# EAGLE board MOMO_2019 (EAGLE 7.3.0)
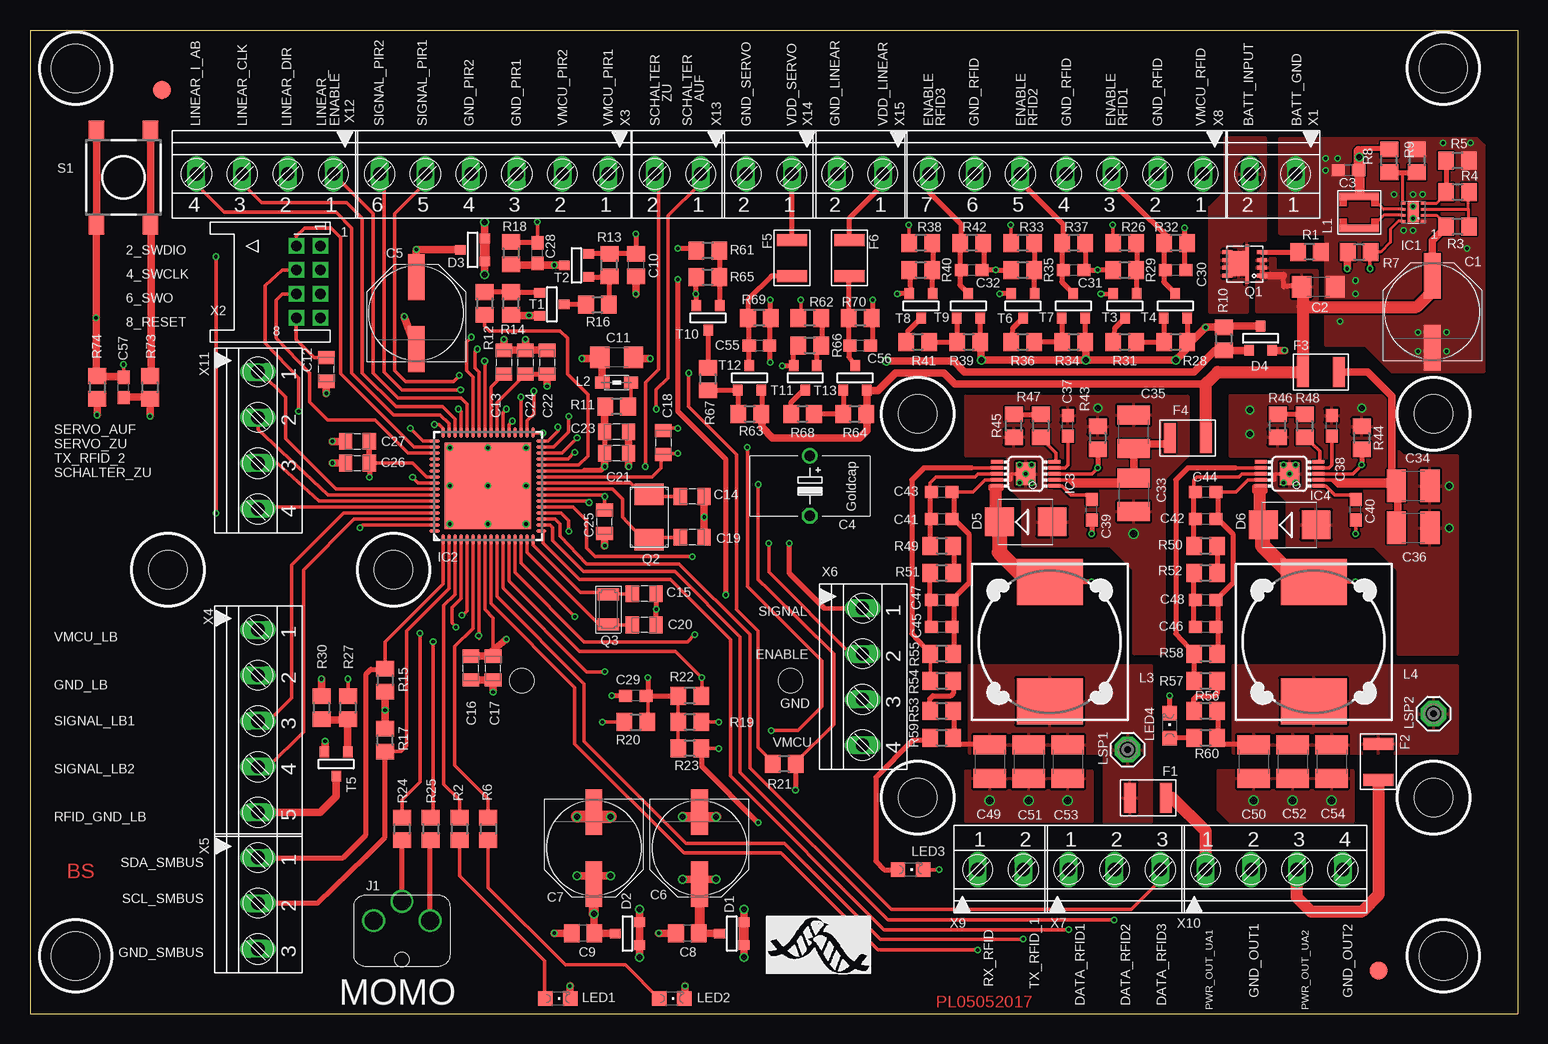
[diagram p6: board, top side]
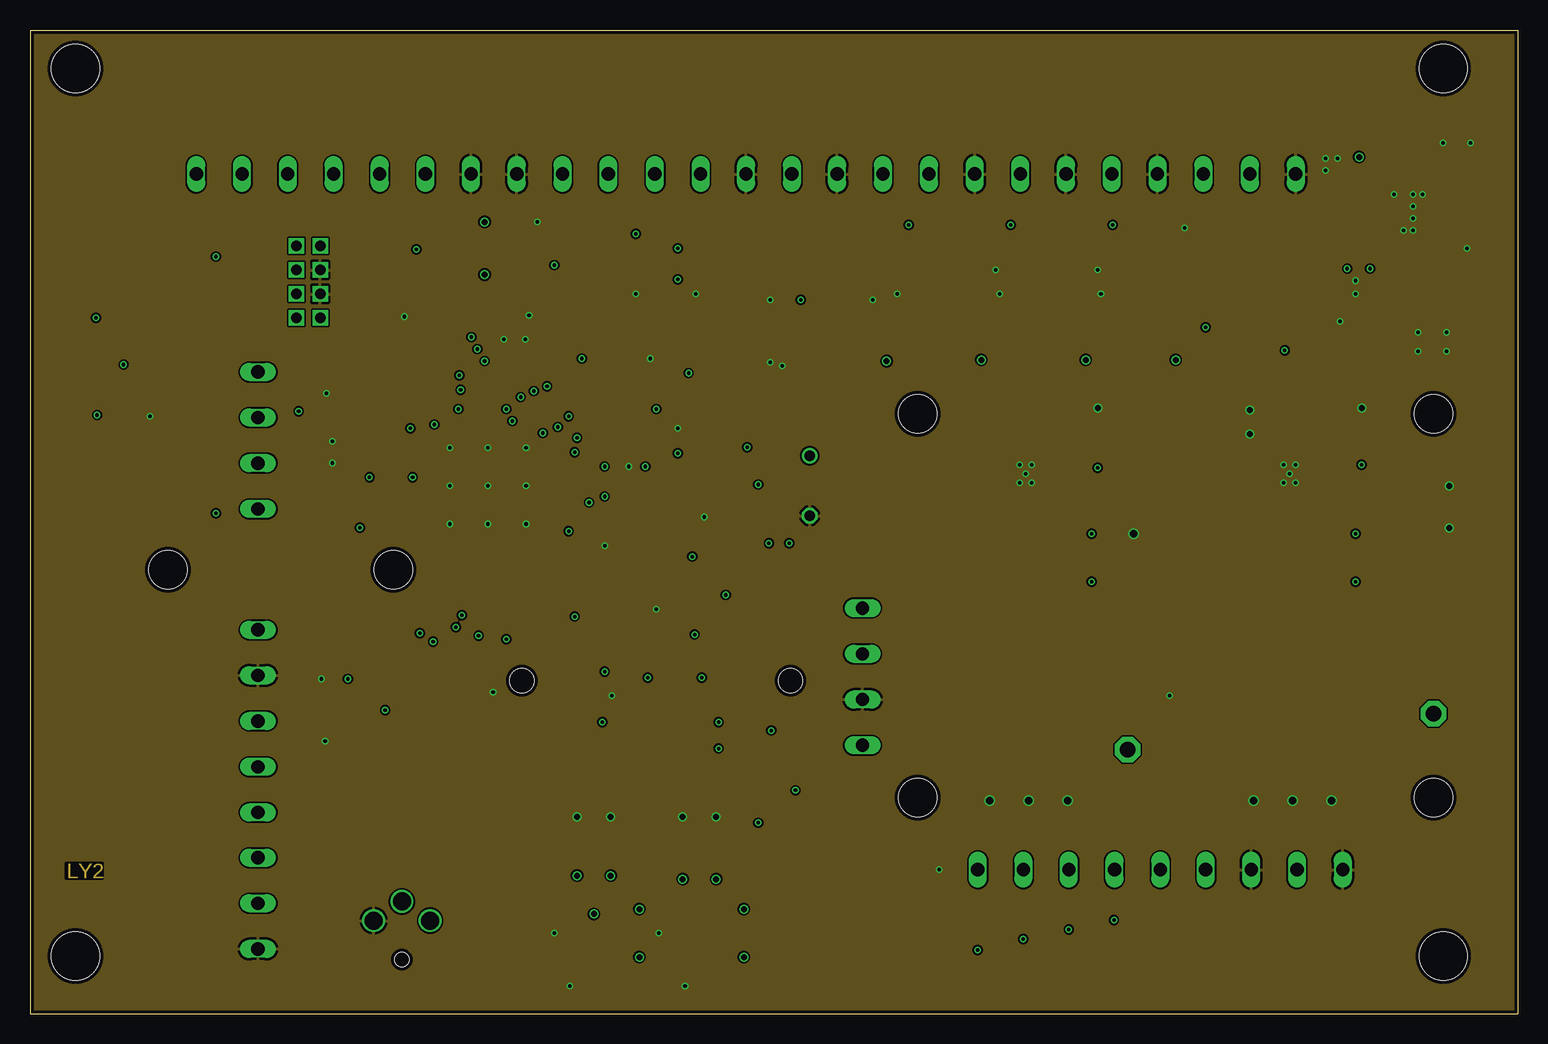
[diagram p7: board, inner layer Route2]
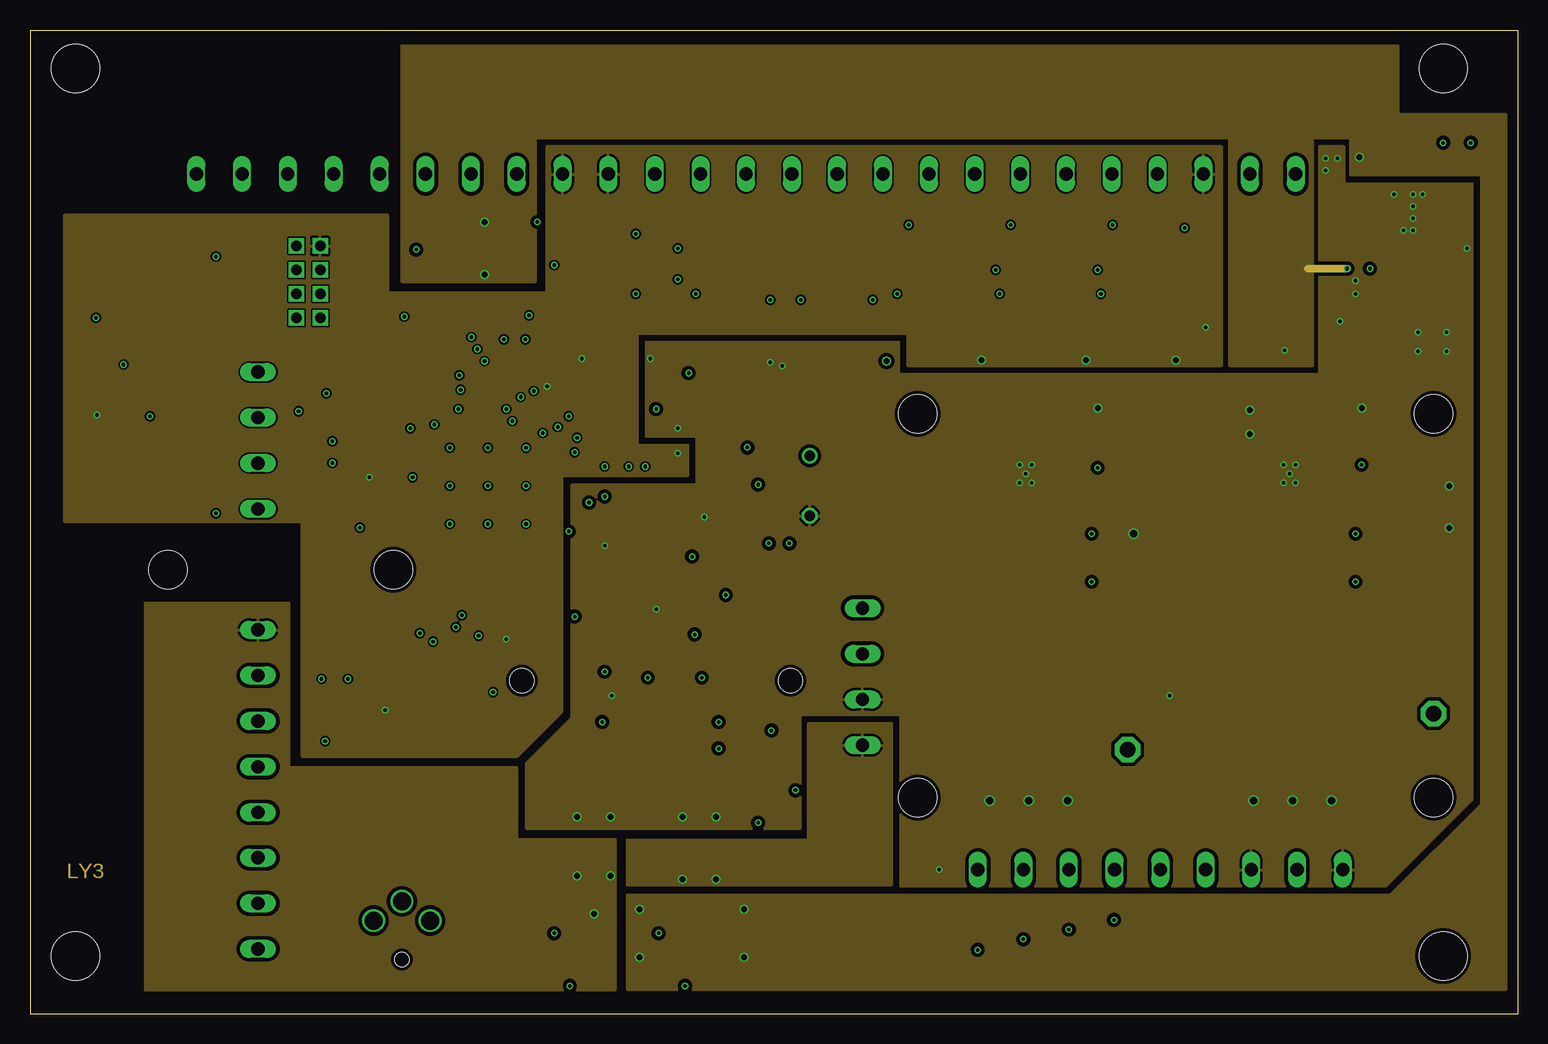
[diagram p8: board, inner layer Route3]
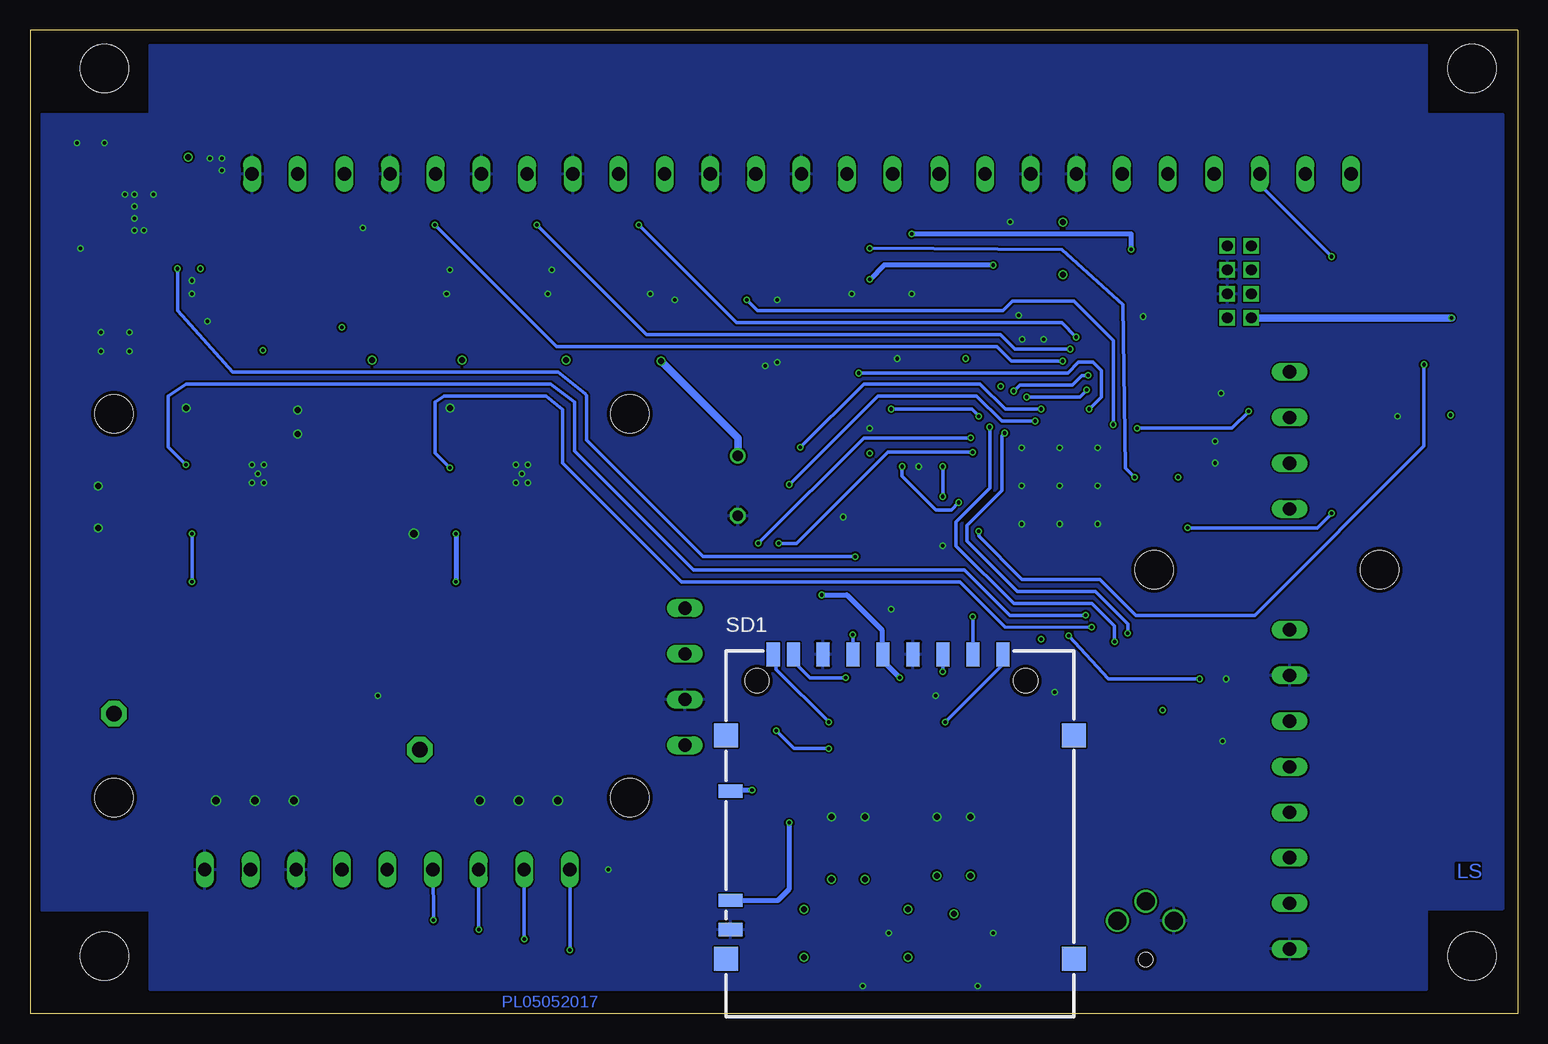
[diagram p9: board, bottom side, seen from below]

Size 124 x 82 mm. Coordinates in mm from the lower left corner, seen from the top.
Outline: 0,0 124,0 124,82 0,82 0,0
Copper layers (1+2*3+16): Top 0.035mm / dielectric 0.2mm / Route2 0.035mm / dielectric 1mm / Route3 0.035mm / dielectric 0.2mm / Bottom 0.035mm
Design rules "PCB-POOL HighSpec *": minimum track width 0.125mm, minimum drill 0.2mm, track to track 0.15mm, track to pad 0.15mm, pad to pad 0.15mm, via to via 0.15mm, smd to smd 0mil, copper to edge 0.3mm, drill to drill 0.2mm, minimum pad ring 0.2mm, minimum via ring 0.125mm, stop-mask expansion 0.075mm, vias tented up to drill 0mil, thermal gap 0.2mm
Net classes: 1 GND: width 0.2 mm; 2 VCC: width 0.25 mm
Holes 4 mm at 3.8,4.8 3.8,78.8 117.8,78.8 117.8,4.8
Holes 3.2 mm at 11.5,37 30.3,37 74,18 117,18 117,50 74,50

## Footprints (pad centres in the part's own frame; a part is rotated, then mirrored left to right if it is on the bottom)
PANASONIC_E = smd 3.8 x 1.4: + 3,0; - -3,0
C1206 = smd 1.6 x 1.8: 1 -1.4,0; 2 1.4,0
C0603 = smd 1.1 x 1: 1 -0.85,0; 2 0.85,0
GOLDCAPSPK-V = drill 0.9: + -2.5,0 | drill 0.9 octagon: - 2.5,0
C0805 = smd 1.3 x 1.5: 1 -0.95,0; 2 0.95,0
0805 = smd 1.092 x 1.397: 1 -0.991,0; 2 0.991,0
C1210 = smd 1.6 x 2.7: 1 -1.4,0; 2 1.4,0
SOT-23$1 = smd 0.787 x 0.889: 1 0.025,-1.016; 2 -0.94,1.016; 3 0.991,1.016
SMB = smd 2.4 x 2.4: A 2.2,0; C -2.2,0
PFUF_1210POLY = smd 1 x 2.5: P$1 -1.5,0; P$2 1.5,0
DSG_PWSO-N8_EXP = smd 0.2 x 0.4: 1 -0.75,-0.85; 2 -0.25,-0.85; 3 0.25,-0.85; 4 0.75,-0.85; 5 0.75,0.85; 6 0.25,0.85; 7 -0.25,0.85; 8 -0.75,0.85 | smd 1.6 x 0.9: EXP 0,0
QFN64 = smd 0.85 x 0.3: 1 -4.45,3.75; 2 -4.45,3.25; 3 -4.45,2.75; 4 -4.45,2.25; 5 -4.45,1.75; 6 -4.45,1.25; 7 -4.45,0.75; 8 -4.45,0.25; 9 -4.45,-0.25; 10 -4.45,-0.75; 11 -4.45,-1.25; 12 -4.45,-1.75; 13 -4.45,-2.25; 14 -4.45,-2.75; 15 -4.45,-3.25; 16 -4.45,-3.75; 33 4.45,-3.75; 34 4.45,-3.25; 35 4.45,-2.75; 36 4.45,-2.25; 37 4.45,-1.75; 38 4.45,-1.25; 39 4.45,-0.75; 40 4.45,-0.25; 41 4.45,0.25; 42 4.45,0.75; 43 4.45,1.25; 44 4.45,1.75; 45 4.45,2.25; 46 4.45,2.75; 47 4.45,3.25; 48 4.45,3.75 | smd 0.3 x 0.85: 17 -3.75,-4.45; 18 -3.25,-4.45; 19 -2.75,-4.45; 20 -2.25,-4.45; 21 -1.75,-4.45; 22 -1.25,-4.45; 23 -0.75,-4.45; 24 -0.25,-4.45; 25 0.25,-4.45; 26 0.75,-4.45; 27 1.25,-4.45; 28 1.75,-4.45; 29 2.25,-4.45; 30 2.75,-4.45; 31 3.25,-4.45; 32 3.75,-4.45; 49 3.75,4.45; 50 3.25,4.45; 51 2.75,4.45; 52 2.25,4.45; 53 1.75,4.45; 54 1.25,4.45; 55 0.75,4.45; 56 0.25,4.45; 57 -0.25,4.45; 58 -0.75,4.45; 59 -1.25,4.45; 60 -1.75,4.45; 61 -2.25,4.45; 62 -2.75,4.45; 63 -3.25,4.45; 64 -3.75,4.45 | smd 7.2 x 7.2: 65 0,0
S-PDSO-G10 = smd 0.3 x 1.02: 1 -1,-2.4; 2 -0.5,-2.4; 3 0,-2.4; 4 0.5,-2.4; 5 1,-2.4; 6 1,2.4; 7 0.5,2.4; 8 0,2.4; 9 -0.5,2.4; 10 -1,2.4 | smd 1.9 x 1.6: EXP 0,0
LUMBERG1502_01 = drill 1.5: P$1 -2.35,0.75; P$2 0,2.35; P$3 2.35,0.75 | hole 1.2: 0,-2.5
LPS3008 = smd 0.63 x 3.3: 1 -1.335,0; 2 1.335,0
0805' = smd 1.2 x 1: 1 -1.2,0; 2 1.2,0
DR127 = smd 3.85 x 5.5: 1 -4.975,0; 2 4.975,0
CHIPLED_0805 = smd 1.2 x 1.2: A 0,-1.05; C 0,1.05
SE13 = drill 1.321 pad 2.159 octagon: MP 0,0
ROUND2_1.5MM = smd 1.5 x 1.5: FID 0,0
TRANSISTOR-FET_1212-8S = smd 0.8 x 0.34: 1 -1.435,0.97; 2 -1.435,0.325; 3 -1.435,-0.325; 4 -1.435,-0.975; 5 1.435,-0.975; 6 1.435,-0.325; 7 1.435,0.325; 8 1.435,0.975 | smd 0.3 x 0.8: 9 -0.2,-1.225; 10 -0.2,1.25 | smd 1.7 x 2.1: 11 0.5,-0.015
CRYSTAL2P5.0X3.2 = smd 1.8 x 2.4: 1 -1.9,0; 2 1.9,0
CRYSTAL2P3.2X1.5 = smd 1 x 1.8: 1 -1.25,0; 2 1.25,0
R0805 = smd 1.3 x 1.5: 1 -0.95,0; 2 0.95,0
DTSM-6 = smd 1.55 x 1.3: 1 -3.975,2.25; 2 3.975,2.25; 3 -3.975,-2.25; 4 3.975,-2.25
DM1AA-SF-PEJ = smd 1.1 x 2: 1 6.1,14.95; 2 3.6,14.95; 3 1.1,14.95; 4 -1.4,14.95; 5 -3.9,14.95; 6 -6.4,14.95; 7 -8.85,14.95; 8 -10.55,14.95; 9 8.6,14.95 | smd 2 x 1.1: CDS -14.1,3.55; COM -14.1,-8; WPS -14.1,-5.566 | smd 2 x 2: G1 -14.5,8.2; G2 -14.5,-10.45; G3 14.5,-10.45; G4 14.5,8.2 | hole 2: -11.9,12.75; 10.5,12.75
ZETEX_SOT-23 = smd 0.787 x 0.889: 1 0.025,-1.016; 2 -0.94,1.016; 3 0.991,1.016
SOT-23 = smd 0.787 x 0.889: 1 0.025,-1.016; 2 -0.94,1.016; 3 0.991,1.016
2POL381 = drill 1.1 long: 1 0,0; 2 3.81,0
DP11_8DP-2DS = drill 0.9 square: 1 3,-9.2; 2 3,-7.2; 3 1,-9.2; 4 1,-7.2; 5 -1,-9.2; 6 -1,-7.2; 7 -3,-9.2; 8 -3,-7.2
6POL381 = drill 1.1 long: 1.1 0,0; 1.2 3.81,0; 1.3 7.62,0; 1.4 11.43,0; 1.5 15.24,0; 1.6 19.05,0
5POL381 = drill 1.1 long: 1 0,0; 2 3.81,0; 3 7.62,0; 4 11.43,0; 5 15.24,0
3POL381 = drill 1.1 long: 1 0,0; 2 3.81,0; 3 7.62,0
4POL381 = drill 1.1 long: 1 0,0; 2 3.81,0; 3 7.62,0; 4 11.43,0
7POL381 = drill 1.1 long: 1 0,0; 2 3.81,0; 3 7.62,0; 4 11.43,0; 5 15.24,0; 6 19.05,0; 7 22.86,0

## Placement (x,y rotation side)
C1  100µF/25V  [PANASONIC_E]  116.9,58.5 90 top
C2  10µF/25V  [C1206]  107.4,60.6 0 top
C3  22µF/10V  [C0603]  109.9,70.3 180 top
C4  EECS0HD 224;Panasonic  [GOLDCAPSPK-V]  65,44 270 top
C5  100µF/25V  [PANASONIC_E]  32.2,58.4 90 top
C6  100µF/25V  [PANASONIC_E]  55.8,13.8 270 top
C7  100µF/25V  [PANASONIC_E]  47,13.8 270 top
C8  100nF/16V  [C0805]  54.8,6.7 180 top
C9  100nF/16V  [C0805]  46.1,6.7 180 top
C10  100nF/16V  [C0805]  50.5,62.4 270 top
C11  10µ/25V  [C1206]  48.9,54.7 180 top
C12  100n  [0805]  24.7,53.7 90 top
C13  1u  [0805]  39.5,54.3 270 top
C14  12p  [0805]  55.2,43.1 180 top
C15  18p  [0805]  51.2,35 180 top
C16  100n  [0805]  36.75,28.8 90 top
C17  100n  [0805]  38.6,28.8 90 top
C18  100n  [0805]  52.8,47.6 270 top
C19  12p  [0805]  55.2,39.7 180 top
C20  18p  [0805]  51.2,32.4 180 top
C21  10µ  [0805]  48.9,46.7 180 top
C22  100n  [0805]  43.1,54.3 270 top
C23  100n  [0805]  48.9,48.5 180 top
C24  100n  [0805]  41.3,54.3 270 top
C25  100n  [0805]  47.9,41 90 top
C26  100n  [0805]  27.3,45.9 0 top
C27  10µ  [0805]  27.3,47.7 0 top
C28  100nF  [C0603]  42.3,63.4 90 top
C29  100nF  [C0603]  50.5,26.5 180 top
C30  100nF  [C0603]  95.5,62 0 top
C31  100nF  [C0603]  87,62 0 top
C32  100nF  [C0603]  78.5,62 0 top
C33  4.7µF  [C1210]  92,43.25 270 top
C34  4.7µF  [C1210]  115.3,44 0 top
C35  n.b.  [C1210]  92,48.5 90 top
C36  n.b.  [C1210]  115.3,40.5 0 top
C37  10nF  [C0603]  86.5,49 90 top
C38  10nF  [C0603]  108.5,49 90 top
C39  100nF  [C0603]  88.5,42 90 top
C40  100nF  [C0603]  110.5,42 90 top
C41  n.b.  [C0603]  76,41.25 0 top
C42  n.b.  [C0603]  98,41.25 0 top
C43  4.3nF  [C0603]  76,43.5 0 top
C44  4.3nF  [C0603]  98,43.5 0 top
C45  24pF  [C0603]  76,32.25 0 top
C46  24pF  [C0603]  98,32.25 0 top
C47  n.b.  [C0603]  76,34.5 0 top
C48  n.b  [C0603]  98,34.5 0 top
C49  22µF  [C1210]  80,21 270 top
C50  22µF  [C1210]  102,21 270 top
C51  22µF  [C1210]  83.25,21 270 top
C52  22µF  [C1210]  105.25,21 270 top
C53  n.b.  [C1210]  86.5,21 270 top
C54  n.b.  [C1210]  108.5,21 270 top
C55  100nF  [C0603]  60.8,55.7 0 top
C56  100nF  [C0603]  69.2,55.7 0 top
C57  10n  [C0603]  7.8,52.2 90 top
D1  BAT54C  [SOT-23$1]  58.5,6.7 270 top
D2  BAT54C  [SOT-23$1]  49.8,6.7 270 top
D3  BAT54C  [SOT-23$1]  36.9,63.7 270 top
D4  BAT54C  [SOT-23$1]  102.6,56.3 180 top
D5  B360B  [SMB]  83,41 0 top
D6  B360B  [SMB]  105,40.75 0 top
F1  MF-USMF110  [PFUF_1210POLY]  93.2,18 0 top
F2  MF-USMF110  [PFUF_1210POLY]  112.4,21 270 top
F3  MF-USMF150  [PFUF_1210POLY]  107.6,53.5 0 top
F4  MF-USMF150  [PFUF_1210POLY]  96.5,48 180 top
F5  MF-USMF110  [PFUF_1210POLY]  63.5,63 90 top
F6  MF-USMF110  [PFUF_1210POLY]  68.3,63 90 top
IC1  TPS62125  [DSG_PWSO-N8_EXP]  115.3,66.8 90 top
IC2  EFM32G230F128  [QFN64]  38.17,43.99 90 top
IC3  TPS54240DGQR  [S-PDSO-G10]  83,45 90 top
IC4  TPS54240DGQR  [S-PDSO-G10]  105,45 90 top
J1  LUMBERG1502_01  [LUMBERG1502_01]  31,7 0 top
L1  LPS3008/22µH  [LPS3008]  110.8,66.8 90 top
L2  BLM21B102S  [0805']  48.9,52.6 0 top
L3  PIS4728-220M-04  [DR127]  85,31 270 top
L4  PIS4728-220M-04  [DR127]  107,31 270 top
LED1  SML-H12U8TT86  [CHIPLED_0805]  44,1.25 270 top
LED2  SML-H12Y8TT86  [CHIPLED_0805]  53.5,1.25 270 top
LED3  (n.b.)  [CHIPLED_0805]  73.4,12 270 top
LED4  (n.b.)  [CHIPLED_0805]  95,24 0 top
LSP1  (n.b.)SE13  [SE13]  91.5,22 90 top
LSP2  (n.b.)SE13  [SE13]  117,25 90 top
PASS1  ROUND_1MM1.5  [ROUND2_1.5MM]  11,77 0 top
PASS2  ROUND_1MM1.5  [ROUND2_1.5MM]  112.4,3.6 0 top
Q1  SI7121DN  [TRANSISTOR-FET_1212-8S]  101.25,62.5 180 top
Q2  NX5032GA/32MHz/8pF  [CRYSTAL2P5.0X3.2]  51.6,41.4 270 top
Q3  CM7V, 32768Hz/12.5pF  [CRYSTAL2P3.2X1.5]  48.2,33.7 270 top
R1  100k  [R0805]  106.65,63.5 180 top
R2  1K2  [R0805]  35.8,15.4 270 top
R3  1M47  [R0805]  119,65.6 180 top
R4  200K  [R0805]  119,68.5 0 top
R5  30K9  [R0805]  119,71.1 180 top
R6  1K2  [R0805]  38.2,15.4 270 top
R7  100K  [R0805]  110.8,63.5 0 top
R8  2M  [R0805]  113.3,71.1 90 top
R9  560K  [R0805]  115.6,71.1 270 top
R10  100  [R0805]  99.5,56.25 270 top
R11  1  [R0805]  48.9,50.6 180 top
R12  100  [R0805]  37.9,59.2 270 top
R13  100K  [R0805]  48.3,62.4 90 top
R14  100K  [R0805]  40.1,59.2 90 top
R15  1K  [R0805]  29.6,27.8 270 top
R16  100  [R0805]  47.3,59.1 0 top
R17  1K  [R0805]  29.6,22.8 90 top
R18  100K  [R0805]  40.1,63.4 270 top
R19  10K  [R0805]  55,24.3 180 top
R20  10K  [R0805]  50.5,24.3 0 top
R21  1K  [R0805]  62.88,20.81 180 top
R22  1K  [R0805]  55,26.5 180 top
R23  (n.b.)10K  [R0805]  55,22.1 180 top
R24  10K  [R0805]  31,15.4 270 top
R25  10K  [R0805]  33.4,15.4 270 top
R26  100  [R0805]  91.25,64.25 180 top
R27  100  [R0805]  26.5,25.5 270 top
R28  100K  [R0805]  95.5,56 0 top
R29  100K  [R0805]  91.25,62 0 top
R30  100K  [R0805]  24.3,25.5 270 top
R31  100  [R0805]  91.25,56 0 top
R32  100K  [R0805]  95.5,64.25 180 top
R33  100  [R0805]  82.75,64.25 180 top
R34  100K  [R0805]  87,56 0 top
R35  100K  [R0805]  82.75,62 0 top
R36  100  [R0805]  82.75,56 0 top
R37  100K  [R0805]  87,64.25 180 top
R38  100  [R0805]  74.25,64.25 180 top
R39  100K  [R0805]  78.25,56 0 top
R40  100K  [R0805]  74.25,62 0 top
R41  100  [R0805]  74,56 0 top
R42  100K  [R0805]  78.5,64.25 180 top
R43  100K  [R0805]  89,48 270 top
R44  100K  [R0805]  111,48 270 top
R45  348K  [R0805]  82,49 90 top
R46  348K  [R0805]  104,49 90 top
R47  0  [R0805]  84.25,49 270 top
R48  0  [R0805]  106.25,49 270 top
R49  39K  [R0805]  76,39 0 top
R50  39K  [R0805]  98,39 0 top
R51  0  [R0805]  76,36.75 0 top
R52  0  [R0805]  98,36.75 0 top
R53  0  [R0805]  76,25.25 0 top
R54  53K  [R0805]  76,27.75 0 top
R55  10k  [R0805]  76,30 180 top
R56  0  [R0805]  98,25.25 0 top
R57  53K  [R0805]  98,27.75 0 top
R58  10K  [R0805]  98,30 180 top
R59  (n.b.)  [R0805]  76,23 0 top
R60  (n.b.)  [R0805]  98,23 0 top
R61  100  [R0805]  56.5,63.6 180 top
R62  100  [R0805]  65,58 180 top
R63  100K  [R0805]  60,50 0 top
R64  100K  [R0805]  68.75,50 0 top
R65  100K  [R0805]  56.5,61.4 0 top
R66  100K  [R0805]  65,55.7 0 top
R67  100  [R0805]  56.5,52.9 270 top
R68  100  [R0805]  64.4,50 0 top
R69  100K  [R0805]  60.8,58 180 top
R70  100K  [R0805]  69.2,58 180 top
R73  100  [R0805]  10,52.2 270 top
R74  100K  [R0805]  5.6,52.2 270 top
S1  SWPB_B3S1000  [DTSM-6]  7.8,69.7 90 top
SD1  DM1AA-SF-PEJ  [DM1AA-SF-PEJ]  51.5,15 0 bottom
T1  2N7002  [ZETEX_SOT-23]  43.5,59.1 90 top
T2  FDN358P  [ZETEX_SOT-23]  45.55,62.4 270 top
T3  2N7002  [ZETEX_SOT-23]  91.25,59 0 top
T4  FDN358P  [ZETEX_SOT-23]  95.5,59 180 top
T5  FDV301N  [SOT-23]  25.5,20.8 0 top
T6  2N7002  [ZETEX_SOT-23]  82.75,59 0 top
T7  FDN358P  [ZETEX_SOT-23]  87,59 180 top
T8  2N7002  [ZETEX_SOT-23]  74.25,59 0 top
T9  FDN358P  [ZETEX_SOT-23]  78.25,59 180 top
T10  2N7002  [ZETEX_SOT-23]  56.5,58 0 top
T11  2N7002  [ZETEX_SOT-23]  64.6,53 0 top
T12  FDN358P  [ZETEX_SOT-23]  60,53 180 top
T13  FDN358P  [ZETEX_SOT-23]  68.8,53 180 top
U$2  [MPIO-ICON]  61.4,3.3 0 top
X1  MKDS1/2-3,81  [2POL381]  105.5,70 180 top
X2  DF11_8DP_2DS  [DP11_8DP-2DS]  15,61 90 top
X3  MKDS1/6-3,81  [6POL381]  48.2,70 180 top
X4  MKDS1/5-3,81  [5POL381]  19,32 270 top
X5  MKDS1/3-3,81  [3POL381]  19,13 270 top
X6  MKDS1/4-3,81  [4POL381]  69.4,33.8 270 top
X7  MKDS1/3-3,81  [3POL381]  86.6,12 0 top
X8  MKDS1/7-3,81  [7POL381]  97.8,70 180 top
X9  MKDS1/2-3,81  [2POL381]  79,12 0 top
X10  MKDS1/4-3,81  [4POL381]  98,12 0 top
X11  MKDS1/4-3,81  [4POL381]  19,53.5 270 top
X12  MKDS1/4-3,81  [4POL381]  25.3,70 180 top
X13  MKDS1/2-3,81  [2POL381]  55.9,70 180 top
X14  MKDS1/2-3,81  [2POL381]  63.5,70 180 top
X15  MKDS1/2-3,81  [2POL381]  71.1,70 180 top

## Tracks (layer width: path | path; a pad name or v marks a point on that pad's centre or on a via)
1  (via drill 0.3, 0.5)
  Top 0.254: IC1.6 112.85,67.05 111.8,68.1 111.14,68.1 L1.2
  Top 0.406: 104.6,55.28 v104.6,55.3 | 112.9,72.1 110.95,72.1 110.75,71.9
  Top 0.61: D4.2 104.6,55.28 | D2.2 D2.3 50.8,5.71 | D3.2 37.9,64.62 | 37.9,62.71 D3.3 37.9,62.7 | 110.75,71.45 v110.8,71.4 | R8.2 112.95,72.05 112.9,72.1 | 110.8,68.3 L1.2 | R7.1 109.8,63.5 v109.8,62.1 | v50.8,8.7 50.8,5.71 | 50.8,5.71 v50.8,4.7 | v59.5,8.7 v59.5,4.7 59.52,4.7 D1.3 | 37.9,62.7 v37.9,66 | 37.9,62.7 v37.9,61.6
  Top 0.813: 59.5,5.69 arc-90 D1.3 D1.2 | 37.9,64.62 37.9,62.71 | 110.75,71.9 110.75,71.45 C3.1 110.8,70.35 110.8,68.3
  Route3 0.61: 106.5,62.1 v109.8,62.1
  pour Route3 (isolate 0.305): 42.1,73 42.1,61 31,61 31,80.7 114,80.7 114,75 123,75 123,2 49.8,2 49.8,9.9 113.4,9.9 121,17.5 121,69.9 110.1,69.9 110.1,73 106.9,73 106.9,54 100,54 100,73
_
  Top 0.254: Q1.9 101.3,62.17 Q1.11
  pour Top: 103,73 99.6,73 99.6,68.5 98.3,67.2 98.3,58.5 101.5,58.5 101.5,64.5 103,64.5
AVDD  (via drill 0.3)
  Top 0.305: IC2.27 46.04,45.24 46.2,45.3 | IC2.23 47.76,43.24 v47.9,43.1 C25.2
  Top 0.406: 47.78,48.5 C23.2 | 46.2,45.3 47.6,45.3 v47.9,45.6 | C23.2 C21.2
  Top 0.61: R11.2 47.9,50.6 C23.2 | v47.9,45.6 C21.2
  Bottom 0.305: v47.9,43.1 v47.9,45.6
BATT_INPUT
  Top 0.254: IC1.2 117.25,66.55 117.7,66.1 117.7,65.95 R3.2
  Top 0.406: 69.75,49.95 R64.2 69.75,50 | 69.75,51.92 T13.2 | Q1.3 Q1.2 Q1.1 | T12.2 60.98,51.98 61,52 61,50.05 R63.2 61,50 | 106.1,58.9 106.1,60.63 104.8,60.63 104.5,60.6 104.5,61.53
  Top 0.61: 69.75,49.95 69.75,48.6 69.15,48 61.9,48 61,48.9 61,50 | 69.75,50 69.75,51.92 70.67,51.92 72.15,53.4 76.2,53.4 77.1,52.5 98.03,52.5 98.12,52.4 98.12,52.62 | Q1.1 104.5,61.53 | 106.1,59.8 C2.1 | 118,65.55 R3.2 116.9,64.45 C1.+
  Top 1.016: 106.1,59.8 106.1,58.9 | 106.1,58.9 F3.P$1 99,53.5 98.12,52.62 98,52.5 F4.P$1 | 106.1,58.9 115.6,58.9 116.9,60.2 C1.+
  pour Top: 102.25,63 103.75,63 103.75,62 107.25,62 107.25,58.5 102.25,58.5
GND  (via drill 0.3, 0.5, 0.6)
  Top 0.305: 77,43.5 C43.2 78.6,43.5 79.6,44.5 IC3.9 81.75,44.5 81.75,45 IC3.EXP | 77,41.4 C41.2 77,41.25 | C47.2 77,34.5 | 77,32.4 C45.2 77,32.25 | 77,30.15 R55.1 | LED3.C v75.8,12 | R55.1 76.75,30 | R55.1 77,30 | IC4.EXP 103.75,45 103.75,44.5 IC4.9 101.5,44.5 100.5,43.5 99,43.5 C44.2 | 99,41.4 C42.2 | C28.2 v42.3,66 | LED1.C 45,1 | LED2.C 54.6,1.3 | v54,48.8 52.8,48.8 C18.1
  Top 0.406: 77,43.5 77,41.4 | 77,41.25 78.25,40 78.25,35.9 C47.2 | 77,34.5 77,32.4 | 77,32.25 77,30.15 | 99,43.5 99,41.4 | C42.2 99,41.25 100.25,40 100.25,35.9 C48.2 99,34.5 99,32.4 C46.2 99,32.25 99,30.15 R58.1 | LED4.C v95,26.5 | C31.2 88,62 | 88,62 88,64.25 R37.1 | R29.1 v89,62 88,62 | v89.27,60 90.31,60 T3.2 | R32.1 96.25,64.15 96.25,62.25 96.35,62.15 C30.2 96.25,62 v96.25,65.5 | R42.1 79.35,64.15 79.5,64 79.5,62.15 C32.2 v80.5,62 R35.1 81.81,61.91 | T6.2 81.02,60.02 v80.84,60 | R40.1 73.4,60.11 T8.2 72.52,60.02 v72.28,60 | 55.56,60.95 R65.1 55.5,61.35 v55.5,60 55.5,59.18 T10.2 | R66.1 63.66,55.66 T11.2 63.56,54 v62.7,54 | C56.2 70.1,56 70.25,56 70.25,58 | R70.1 70.25,58 | 70.25,58 v70.25,59.5 | v61.7,59.5 61.7,58.1 | 61.7,58.1 61.75,58.05 R69.1 | 40.64,58.21 R14.1 | T1.2 42.53,58.17 | C29.2 v48.5,26.5 | C15.1 52.2,34.95 v52.2,33.7 52.2,32.46 C20.1 | 42.53,58.17 42.55,58.15 | 42.53,58.17 42.5,58.2 | v41.35,47.16 41.35,46.95 38.2,43.8 38.2,44 | R18.1 40.5,64.3 42.25,64.3 C28.2 | v61.7,54.3 61.7,55.6 | 61.7,55.6 61.7,58.1 | C55.2 61.65,55.65 61.7,55.6
  Top 0.61: v25.2,45.9 C26.1 | v25.2,47.7 C27.1 | 45,1 v45,2.3 | v47.9,39 C25.1 | 54.6,1.3 v54.6,2.3 | v38.6,26.8 C17.1 C16.1 | C9.2 v43.7,6.7 | C57.1 7.8,51.4 9.85,51.4 R73.2 v10,49.8 | T1.2 42.52,58.2 v41.6,58.2 40.1,58.2 R14.1 | v41.3,56.2 C24.1 | C24.1 C22.1 | C24.1 C13.1 | C24.1 | v50.5,60 C10.2 | C23.1 v49.9,45.6 49.9,46.39 C21.1 | v51.7,54.6 50.3,54.6 C11.1 | 56.2,41.19 C14.1 | v56.2,41.4 56.2,41.19 | 56.2,41.19 C19.1 | v39.5,56.2 C13.1 | v24.6,22.7 24.6,21.82 T5.2 | v24.3,27.9 R30.1 | C5.- v31.2,58.1 | v52.4,6.7 C8.2 | C12.1 v24.7,51.7
  Top 0.813: v54.4,16.4 55.8,16.4 | 55.8,16.4 v57.2,16.4 | C6.- 55.8,16.4
  Top 1.016: C7.- 47,16.4 v48.4,16.4 v45.6,16.4
  other vias: 35,47.16 38.17,47.16 41.35,43.99 38.17,43.99 35,43.99 35,40.81 38.17,40.81 41.35,40.81 80,17.75 83.25,17.75 86.5,17.75 92,40 89,50.5 82.5,45.75 83.5,45.75 83.5,44.25 82.5,44.25 83,45 104.5,45.75 105.5,45.75 105.5,44.25 104.5,44.25 105,45 102,17.75 105.25,17.75 108.5,17.75 118.3,44 118.3,40.5 111,50.5 120.1,72.6 118.1,56.8 118.1,55.2 101.7,50.3 101.7,48.3 108,71.3 109,71.3 108,70.3 115.3,68.3 115.3,65.3 115.7,55.2 115.7,56.8 119.8,63.8 114.5,65.3 116.1,68.3 117.8,72.6 113.7,68.3 115.3,67.3 115.3,66.3 109.2,57.7 110.5,60 110.5,61.1
  pour Bottom: 1.25,8.7 7.6,8.7 7.6,2 114,2 114,8.6 123,8.6 123,75 114,75 114,80.75 7.6,80.75 7.6,75 1.25,75
  pour Top: 81.5,44 81.5,46.5 78,46.5 78,51.5 96.5,51.5 96.5,46.5 94.5,44.5 94.5,30 92,30 92,37 90,39 82.75,39 82.75,42.75
  pour Top: 78,20.25 88.5,20.25 88.5,16 78,16
  pour Top: 104.75,39 112,39 114,37 114,30 119,30 119,46.5 114.5,46.5 113,48 113,51.5 100,51.5 100,46.5 103.5,46.5 103.5,44 104.75,42.75
  pour Top: 99,20.25 99,17 100,16 110.3,16 110.3,19.9 110.3,20.25
  pour Top (no thermals): 104.2,73 120.6,73 121.2,72.4 121.2,53.5 113.5,53.5 111.3,55.7 108,55.7 108,65 104.2,65
  pour Route2: 0.3,81.7 123.7,81.7 123.7,0.3 0.3,0.3
  pour Route3 (isolate 0.305): 107.5,72.3 109.5,72.3 109.5,69.2 120.2,69.2 120.2,17.8 113,10.6 72.6,10.6 72.6,24.9 64.2,24.9 64.2,15.4 41.4,15.4 41.4,20.9 45.2,24.7 45.2,44.1 55.6,44.1 55.6,48.1 51.4,48.1 51.4,56 72.4,56 72.4,53.3 107.5,53.3
MCU_RESET  (via drill 0.3)
  Top 0.305: IC2.20 44.26,41.74 44.9,41.1 v44.9,40.2 | v7.8,54.1 C57.2 | X2.8 22.2,56.2 23.7,54.7 C12.2
  Top 0.61: S1.2 S1.1 5.53,65.72 5.5,65.7 v5.5,58 5.5,53.25 | 5.55,53.2 R74.1 | R74.1 5.6,53.2 | R74.1 5.6,53.1 7.75,53.1 C57.2 7.8,53.1 5.5,53.1 5.5,53.25 | 5.5,53.25 R74.1
  Bottom 0.305: v44.9,40.2 44.9,39.8 41.3,36.2 34.8,36.2 31.8,33.2 21.9,33.2 7.8,47.3 v7.8,54.1
  Bottom 0.61: v5.5,58 X2.8
N$2
  Top 0.305: LED2.A 49.65,4.05 44.65,4.05 38.2,10.5 R6.2
N$3  (via drill 0.5)
  Top 0.406: 99.5,55.28 R10.2
  Top 0.61: 99.53,55.23 R10.2 98.76,55.26 97,53.5 77.9,53.5 77,54.4 v71.4,54.4 | D4.3 99.5,55.28
  Bottom 0.61: C4.+ 65,48 v71.4,54.4
N$4
  Top 0.406: R31.2 R28.1 94.51,55.89 T4.3
N$5
  Top 0.254: IC1.3 119.9,67.05 | 119.9,67.05 119.9,68.6 R4.2 | 119.9,67.05 119.9,65.3 R3.1
N$6
  Top 0.406: T3.1 90.4,57.11 R31.1
N$7
  Top 0.406: T3.3 | T3.3 92.25,60 | T3.3 92.25,62 | R26.1 92.25,64.25 92.25,62 | 92.25,62 R29.2
N$8
  Top 0.254: IC1.4 117.25,67.55 117.6,67.9 117.6,68.05 R4.1
  Top 0.406: R5.2 R4.1
N$9
  Top 0.254: IC1.7 112.85,66.55 111.9,65.6 111.7,65.6 111.8,65.6 111.19,65.55 L1.1
N$10
  Top 0.406: T9.3 77.26,55.75 R39.1 R41.2
N$11
  Top 0.406: T8.1 73.15,56.86 R41.1
N$12
  Top 0.61: T5.3 R27.2 26.5,24.5 | 26.5,24.5 26.6,24.5 | 26.5,24.5 24.3,24.5 R30.2
N$13
  Top 0.406: R38.1 75.25,64.25 75.25,62.5 | 75.25,62.5 75.25,62.15 R40.2 | T8.3 75.24,62.49 75.25,62.5
N$14
  Top 0.305: R11.1 50.1,50.6 L2.2
N$15
  Top 0.406: T2.3 47.56,61.41 47.55,61.4 48.15,61.4 R13.1 48.3,59.15 R16.2
N$16
  Top 0.406: T1.1 44.57,59.17 44.8,59.15 46.25,59.15 46.3,59.1 R16.1
N$17
  Top 0.406: T1.3 40.41,60.09 40.4,60.1 40.69,60.14 R14.2 | R14.2 40.55,60.15 | R14.2 R12.1
N$19
  Top 0.305: IC3.1 86,44 86.75,43.25 88.35,43.25 C39.2
N$20
  Top 0.305: 104.88,63.48 R1.2
  Top 0.406: Q1.4 105.3,63.48 R1.2
N$21  (via drill 0.3)
  Top 0.305: v47.7,24.3 R20.1
  Bottom 0.305: SD1.9 42.9,29.1 v47.7,24.3
N$22  (via drill 0.3)
  Top 0.305: v57.4,24.3 R19.1
  Bottom 0.305: SD1.8 62.05,29.3 61.8,29.05 61.8,28.7 v57.4,24.3
N$24
  Top 0.406: R67.2 56.55,52 58.99,52 T12.3 59,52 59,50.05 R63.1
N$25
  Top 0.406: T10.1 56.52,53.88 R67.1
N$26  (via drill 0.3)
  Top 0.305: 80.5,43.5 80.5,44 80,44 80,43.75 81,43.75 81,44 IC3.10
  Top 0.406: C39.1 v88.5,40 | v88.5,36 85,36 L3.1
  Top 1.016: 80.5,41.25 80.5,43.5
  Top 1.27: L3.1 84.47,36.5 82.75,36.5 80.8,38.45 D5.C 80.75,41 80.5,41.25
  Bottom 0.406: v88.5,40 v88.5,36
N$27
  Top 0.305: IC3.4 86.25,45.5 86.5,45.75 C37.1
N$28
  Top 0.305: IC3.8 79,45 78.75,44.75 75.5,44.75 75,44.25 75,43.5 | 75,43.5 C43.1 75,43.35 75,43.5 | 75,41.35 C41.1 75,41.25 | 75,39.1 R49.1
  Top 0.406: 75,43.35 75,41.35 | 75,41.25 75,39.1
N$29
  Top 0.305: LED1.A 42.8,1.25 42.8,1.2 42.9,1.3 42.9,4.4 35.8,11.5 R2.2
N$30
  Top 0.305: IC2.40 38.42,52.23 C13.2
N$31
  Top 0.305: C45.1 75,32.25 | 75,34.35 C47.1 75,34.5 | 75,36.6 R51.1
  Top 0.406: 75,32.25 75,34.35 | 75,34.5 75,36.6
N$32
  Top 0.305: IC3.7 78.5,45.5 | R55.2 R54.1
  Top 0.406: 78.5,45.5 74.5,45.5 73.5,44.5 73.5,31.65 R55.2
N$33
  Top 0.305: IC4.1 108,44 108.75,43.25 110.35,43.25 C40.2
N$34  (via drill 0.3)
  Top 0.305: IC4.10 102,44 102,43.5 102.25,43.5 | 102.25,43.5 102.25,43.75 103,43.75 103,43.5 102.5,43.5 102.25,43.5 | C40.1 v110.5,40 | v110.5,36 107.03,36 L4.1
  Top 1.016: L4.1 105.78,35.98 | 102.5,40.75 102.5,43.5
  Top 1.27: 105.78,35.98 102.75,39 102.75,40.7 D6.C 102.5,40.75
  Bottom 0.305: v110.5,40 v110.5,36
N$35
  Top 0.305: IC4.4 108.25,45.5 108.5,45.75 C38.1
N$36
  Top 0.406: T7.3 86.01,55.89 | 86.01,55.89 R34.1 | 86.01,55.89 86.01,55.76 86,56 R36.2
N$37
  Top 0.305: C44.1 97,43.5 97,44.5 97.25,44.75 100.75,44.75 101,45 IC4.8
  Top 0.406: R50.1 97,39 97,41.1 C42.1 97,41.25 97,43.35 C44.1
N$38
  Top 0.406: T6.1 81.9,57.11 R36.1
N$39
  Top 0.406: C46.1 97,32.25 97,34.35 C48.1 97,34.5 97,36.6 R52.1
N$40
  Top 0.305: IC4.7 100.5,45.5
  Top 0.406: 100.5,45.5 96.5,45.5 95.5,44.5 95.5,31.65 R58.2 97.15,29.9 97,29.75 97,27.9 R57.1
N$41
  Top 0.406: R60.1 95.05,23 LED4.A
N$42
  Top 0.406: T6.3 83.74,61.86 R35.2 83.75,62 83.75,64.1 R33.1
N$43
  Top 0.61: S1.4 S1.3 10.05,65.65 10.1,65.6 10.1,53.25 R73.1
N$44
  Top 0.406: R45.2 R47.1
N$45
  Top 0.406: T10.3 57.49,59.19 57.5,59.2 57.5,61.35 R65.2 57.5,61.4 57.5,63.55 R61.1
N$46
  Top 0.254: IC1.5 114.45,70.1
  Top 0.305: 114.45,70.1 114.8,70.1
  Top 0.406: R8.1 113,70.1 114.8,70.1 115.25,70.1 R9.2
N$47
  Top 0.406: R46.2 104,50 106.1,50 R48.1
N$48
  Top 0.305: IC3.5 85.5,46 85.5,46.75 84.25,48 R47.2
N$49
  Top 0.406: R49.2 77,39 77,36.9 R51.2
N$50
  Top 0.305: R53.1 75,25 | 77,27.6 R54.2
  Top 0.406: 75,25 75,26.25 75.25,26.5 76.75,26.5 77,26.75 77,27.6
N$51
  Top 0.305: IC4.5 107.5,46 107.5,46.9 R48.2
N$52
  Top 0.406: R56.1 97,25.25 97,26.25 97.25,26.5 98.75,26.5 99,26.75 99,27.6 R57.2
N$53
  Top 0.406: R52.2 99,36.75 99,38.85 R50.2
N$54
  Top 0.406: R59.1 74.85,22.8 73.6,22.8 70.5,19.7 70.5,12.7 71.2,12 LED3.A
N$55
  Top 0.406: R68.2 R64.1 T13.3
N$56
  Top 0.406: R68.1 63.45,50.95 64.48,51.98 T11.1
N$57
  Top 0.406: R62.1 66,58 66,55.9 R66.2 65.59,55.61 T11.3
N$71
  Top 0.305: IC3.2 86.5,44.5 | 86.5,44.5 91.35,44.5 C33.1 | C33.1 91.5,44 87,44 86.75,44.25 | 86.75,44.25 86.5,44.5 | C33.1 91.1,44.25 86.75,44.25
  Top 0.61: F4.P$2 95,47.5 92,47.5 C35.1 C33.1
N$72
  Top 0.305: IC4.2 108.5,44.5 | 108.75,44.5 114.1,44.5 C34.1 | 114,43.9 113.5,44 109,44 108.5,44.5 | 108.5,44.5 108.75,44.5 | 108.75,44.5 109,44.25 113.5,44.25
  Top 0.61: 114,40.5 C36.1 114,40.6 114,43.9 C34.1 | F3.P$2 111.5,53.5 113.5,51.5 113.5,44.7 114,44.2 114,44.6 114.1,44.5
PA0_SMBUS_SDA
  Top 0.305: IC2.1 34.42,35.83 29.6,31 R15.1
  Top 0.406: X5.1 26.1,13 28,14.9 28,28.3 28.4,28.7 29.55,28.7 R15.1
PA1_SMBUS_SCL
  Top 0.305: IC2.2 34.92,35.42 31.4,31.9 31.4,22.3 30.95,21.85 R17.1
  Top 0.406: X5.2 23.99,9.19 27.94,13.04 29.6,14.7 R17.1
PA2_POWER_LED
  Top 0.305: IC2.3 35.42,34.92 34.48,34.02 34.48,19.12 35.8,17.8 R2.1
PA3_CAM1_ENABLE  (via drill 0.3)
  Top 0.305: IC3.3 88.5,45 v89,45.5 | 89,46.75 R43.2 | IC2.4 35.92,34.59 35.2,33.86 35.2,32.55 v35.5,32.2
  Top 0.406: 89,46.75 v89,45.5
  Bottom 0.305: v89,45.5 90.25,46.75 90.25,51 89.5,51.5 81,51.5 79.6,50.35 79.6,45.9 69.7,36 46.5,36 46.5,35.99 42.74,32.23 v35.5,32.2
PA4_CAM2_ENABLE  (via drill 0.3)
  Top 0.305: 109.25,45 IC4.3 110.25,45 v111,45.75 | IC2.5 36.42,33.57 v36,33.2
  Top 0.406: R44.2 v111,45.75
  Bottom 0.305: v111,45.75 112.5,47.25 112.5,51.5 111,52.5 80.6,52.5 78.6,51 78.6,46.9 68.7,37 46.11,37 42.31,33.2 v36,33.2
PA5_LOG_FLUSH_LED
  Top 0.305: IC2.6 36.92,32.12 35.4,30.6 35.4,20.7 38.2,17.9 R6.1
PA6_RFID_POWER  (via drill 0.3)
  Top 0.305: IC2.7 37.42,31.28 v37.4,31.5 | v26.5,27.9 R27.1
  Bottom 0.305: v37.4,31.5 34.1,27.9 v26.5,27.9
PA8_RFID1_DATA  (via drill 0.3)
  Top 0.305: IC2.17 42.76,40.24 42.76,39.24 45.8,36.2 53.4,36.2 58.4,31.2 58.4,19.8 71.2,7 v86.6,7
  Bottom 0.305: X7.1 v86.6,7
PA9_RFID2_DATA  (via drill 0.3)
  Top 0.305: IC2.18 43.35,40.74 43.55,40.54 43.55,39.45 46.15,36.85 53.75,36.85 59.2,31.4 59.2,20.1 71.5,7.8 v90.36,7.8
  Bottom 0.305: X7.2 v90.36,7.8
PA10_RFID3_DATA
  Top 0.305: IC2.19 43.76,41.24 44.2,40.8 44.2,39.8 46.4,37.5 54.1,37.5 60,31.6 60,20.5 71.8,8.7 91.8,8.7 94.22,11.12 X7.3
PB7_LFXTAL_P
  Top 0.305: IC2.15 41.42,38.45 47.42,32.45 Q3.2 48.3,32.4 C20.2
PB8_LFXTAL_N
  Top 0.305: IC2.16 41.92,39.08 45.9,35.1 48.05,35.1 Q3.1 48.3,35 C15.2
PB11_POWER_GOOD  (via drill 0.3)
  Top 0.254: IC1.8 114.05,66.05 113.4,65.4 113.4,64.3 112.6,63.5 R7.2
  Top 0.305: IC2.21 45.26,42.24 46.4,41.1 46.4,38.8 47.1,38.1 v55.2,38.1 | v111.7,62.1 111.7,63.15 R7.2
  Bottom 0.305: v55.2,38.1 67.9,38.1 77.6,47.8 77.6,51.52 77.74,51.67 80,53.5 107.1,53.5 111.7,58.6 v111.7,62.1
PB12_N_SCHALTER_ZU  (via drill 0.3)
  Top 0.305: IC2.22 46.46,42.74 v46.6,42.6 | v51.3,45.6 51.3,52.6 52.4,53.7 52.4,69.69 X13.2
  Bottom 0.305: v46.6,42.6 47.2,42 48.5,42 51.3,44.8 v51.3,45.6
PB13_HFXTAL_P
  Top 0.305: IC2.24 48.56,43.74 49.4,42.9 49.4,41.4 50.7,40 51.6,40 51.6,39.7 | C19.2 51.6,39.7 | 51.6,39.7 Q2.2
PB14_HFXTAL_N
  Top 0.305: IC2.25 50.06,44.24 51,43.3 Q2.1 51.6,43.1 C14.2
PC0_RFID_RX  (via drill 0.3)
  Top 0.305: IC2.9 38.42,34.17 45.4,27.2 45.4,22.5 54.5,13.4 62.6,13.4 70.7,5.3 v79,5.3
  Bottom 0.305: v79,5.3 X9.1
PC1_RFID_TX  (via drill 0.3)
  Top 0.305: IC2.10 38.92,34.77 46.2,27.5 46.2,22.7 54.7,14.2 62.9,14.2 70.9,6.2 v82.8,6.2
  Bottom 0.305: X9.2 82.8,6.31 v82.8,6.2
PC2_SD_SDO  (via drill 0.3)
  Top 0.305: v47.9,28.5 46.4,28.5 39.42,35.48 IC2.11
  Bottom 0.305: v47.9,28.5 SD1.2
PC3_SD_SDI  (via drill 0.3)
  Top 0.305: IC2.12 39.92,36.08 45.8,30.2 53.8,30.2 v56,28 56,26.5 R22.1
  Bottom 0.305: 60.25,30.05 SD1.7 60.35,29.35 59,28 v56,28
PC4_SD_CLK  (via drill 0.3)
  Top 0.305: IC2.13 40.42,36.77 46.2,31 54.8,31 v55.4,31.6
  Bottom 0.305: v55.4,31.6 55.4,29.85 55.25,29.95 SD1.5
PC5_SD_CS  (via drill 0.3)
  Top 0.305: IC2.14 40.92,37.58 v45.4,33.1
  Bottom 0.305: v45.4,33.1 SD1.1
PC6_SD_CD  (via drill 0.3)
  Top 0.305: IC2.37 39.92,49.12 v40.2,49.4 | 63.81,20.51 63.81,20.8 R21.1 63.83,20.93 67,24.1 67,30 61.6,35.3 60.7,36.2 v60.7,44.1
  Top 0.406: 63.81,20.51 v63.81,18.61
  Bottom 0.305: v40.2,49.4 43,49.4 45.1,51.5 53.3,51.5 v60.7,44.1
  Bottom 0.406: v63.81,18.61 65.56,18.61 SD1.CDS
PC7_SD_WP  (via drill 0.3)
  Top 0.305: IC2.38 39.42,50.12 v39.7,50.4 | R23.1 v57.4,22.1 | v61.8,23.6 64,23.6 66,25.6 66,29.4 59.8,35.6 v59.8,47.2
  Top 0.406: v60.7,15.9 56,20.6 56,22.05 R23.1
  Bottom 0.305: v39.7,50.4 42.7,50.4 44.8,52.5 54.5,52.5 v59.8,47.2 | v57.4,22.1 60.3,22.1 v61.8,23.6
  Bottom 0.406: SD1.WPS 61.67,9.43 60.7,10.4 v60.7,15.9
PC8_RFID1_MOSFET  (via drill 0.3)
  Top 0.305: R26.2 90.25,64.25 v90.25,65.75 | IC2.41 37.92,54.38 v37.9,54.4
  Bottom 0.305: v90.25,65.75 80.1,55.6 43.4,55.6 42.2,54.4 v37.9,54.4
PC9_RFID2_MOSFET  (via drill 0.3)
  Top 0.305: R33.2 81.75,64.25 v81.75,65.75 | IC2.42 37.42,53.48 37.1,53.8 37.1,55.2 v37.3,55.4
  Bottom 0.305: v81.75,65.75 72.6,56.6 43.1,56.6 41.9,55.4 v37.3,55.4
PC10_RFID3_MOSFET  (via drill 0.3)
  Top 0.305: R38.2 73.25,64.25 v73.25,65.75 | IC2.43 36.92,53.08 36.4,53.6 36.4,56 v36.8,56.4
  Bottom 0.305: v73.25,65.75 65.1,57.6 38,57.6 v36.8,56.4
PC11_LINEAR_ENABLE
  Top 0.305: IC2.44 36.42,50.83 35.95,51.3 30.8,51.3 30.7,51.3 28.6,53.4 28.6,53.5 28.6,66.7 X12.1
PC12_SD_PULLUP  (via drill 0.3)
  Top 0.305: IC2.45 35.92,50.17 v35.7,50.4 | v54.9,53.4 54.9,50.6 58.9,46.6 58.9,33.7 60.7,31.9 60.7,22.2 61.9,21 61.9,20.84 R21.2
  Bottom 0.305: v35.7,50.4 34.7,51.4 34.7,53.6 35.4,54.3 36.6,54.3 37.5,53.4 v54.9,53.4
PC13_LINEAR_CLK
  Top 0.305: X12.3 17.68,69.22 19.3,67.6 26.4,67.6 27.7,66.3 27.7,53.4 30.5,50.6 34.4,50.6 35.42,49.58 IC2.46
PC14_LINEAR_I_AB
  Top 0.305: X12.4 13.87,69.13 16.2,66.8 25.5,66.8 26.8,65.5 26.8,53.4 30.3,49.9 34.2,49.9 34.92,49.17 IC2.47
PC15_LA_MOSFET  (via drill 0.3)
  Top 0.305: v33.7,49.1 34.1,49.1 34.42,48.77 IC2.48 | R62.2 64.25,58 v64.25,59.5
  Bottom 0.305: v64.25,59.5 63.35,58.6 42.9,58.6 42.1,59.4 37,59.4 33.7,56.1 v33.7,49.1
PD0_SD_POWER
  Top 0.305: IC2.28 45.74,45.74 46.5,46.5 46.5,51.6 44.8,53.3 44.8,56.3 44.2,56.9 38.3,56.9 37.9,57.3 R12.2
PD1_DCF77_ENABLE  (via drill 0.3)
  Top 0.305: IC2.29 44.84,46.24 v45.4,46.8 | X6.2 68.41,29.99 61.6,36.8 v61.6,39.2
  Bottom 0.305: v61.6,39.2 60.1,39.2 52.5,46.8 v45.4,46.8
PD2_DCF77_SIGNAL  (via drill 0.3)
  Top 0.305: IC2.30 44.34,46.74 v45.6,48
  Top 0.406: v63.3,39.2 63.3,36.7 66.2,33.8 69.3,33.79 X6.1
  Bottom 0.305: v63.3,39.2 54.5,48 v45.6,48
PD3_N_SCHALTER_AUF  (via drill 0.3)
  Top 0.305: IC2.31 43.64,47.24 44.9,48.5 v44.9,49.8 | v52.2,50.4 52.2,52 53.2,53 53.2,66.5 55.9,69.2 X13.1
  Bottom 0.305: v44.9,49.8 45.5,50.4 v52.2,50.4
PD4_LEUART_TX  (via drill 0.3)
  Top 0.305: v33.6,31 33.6,16.5 33.37,16.5 | 33.3,16.5 33.37,16.5 | v44,48.9 44,48.57 43.5,48.07 43.21,47.74 42.66,47.74 IC2.32 | 33.37,16.5 33.27,16.48 R25.1
  Bottom 0.305: v44,48.9 44,43.8 46.8,41 46.8,39 42,34.2 36.3,34.2 35.74,34.19 35.49,34.19 33.6,32.3 v33.6,31
PD5_LEUART_RX  (via drill 0.3)
  Top 0.305: IC2.33 41.92,48.33 42,48.4 v42.75,48.4 | v32.5,31.7 32.5,19.3 31,17.8 R24.1
  Bottom 0.305: v42.75,48.4 43,48.15 43,43.6 45.9,40.7 45.9,39.4 41.7,35.2 35.2,35.2 32.5,32.5 v32.5,31.7
PD6_PIR1_SIGNAL  (via drill 0.3)
  Top 0.305: IC2.34 41.42,49.42 42,50 v42,51.9 | v35.8,53.2 35.3,52.7 31.3,52.7 30.4,53.6 30.4,66.7 32.96,69.26 X3.1.5
  Bottom 0.305: v42,51.9 41.5,52.4 37.1,52.4 36.3,53.2 v35.8,53.2
PD7_PIR2_SIGNAL  (via drill 0.3)
  Top 0.305: IC2.35 40.92,51.38 v40.9,51.4 | X3.1.6 29.15,69.25 29.5,68.9 29.5,53.5 31,52 v35.9,52
  Bottom 0.305: v40.9,51.4 36.5,51.4 v35.9,52
PE8_SERVOPL_MOSFET  (via drill 0.3)
  Top 0.305: IC2.56 32.36,44.24 v31.9,44.7
  Top 0.406: v54,63.8 55.35,63.8 R61.2
  Bottom 0.305: v54,63.8 38,63.7 32.9,59.1 32.7,45.5 v31.9,44.7
PE9_SERVO_AUF
  Top 0.305: IC2.57 25.5,43.74 21.3,47.94 21.3,51.4 19.2,53.5 X11.1
PE10_SERVO_ZU
  Top 0.305: IC2.58 24.85,43.24 19.01,48.69 X11.2
PE11_N_SCHALTER_AUF
  Top 0.305: IC2.59 24.1,42.74 20.62,45.88 X11.3
PE12_N_SCHALTER_ZU
  Top 0.305: IC2.60 19.2,42.24 X11.4
PE13_LB1_SIGNAL
  Top 0.305: IC2.61 26.14,41.74 21.8,37.4 21.8,26.3 19.88,24.38 X4.3
PE14_LB2_SIGNAL
  Top 0.305: IC2.62 27.04,41.24 22.8,37 22.8,23.5 19.87,20.57 X4.4
PE15_LINEAR_DIR  (via drill 0.3)
  Top 0.305: IC2.63 27.74,40.74 v27.5,40.5 | v15.5,41.7 v15.5,63.1
  Bottom 0.305: v27.5,40.5 16.7,40.5 v15.5,41.7 | v15.5,63.1 21.5,69.1 X12.2
PF0_DBG_SWCLK  (via drill 0.3)
  Top 0.305: X2.4 21,62 19.6,60.7 19.6,55.9 22.4,53 v22.4,50.2 | IC2.49 32.76,47.74 v31.7,48.8
  Bottom 0.305: v31.7,48.8 23.8,48.8 v22.4,50.2
PF1_DBG_SWDIO
  Top 0.305: IC2.50 32.01,47.24 25.9,53.35 25.9,64.7 25.1,65.5 22.9,65.5 22.2,64.8 X2.2
PF2_DBG_SWO
  Top 0.305: IC2.51 31.51,46.74 28.75,49.5 24.8,49.5 23.3,51 23.3,53.4 20.5,56.3 20.5,59.5 21,60 X2.6
RFID_GND_LB
  Top 0.406: X4.5 19.02,16.77 | 25.5,19.8 T5.1
  Top 0.61: 19.02,16.77 24.18,16.77 25.5,18.1 25.5,19.8
RXD_HOST
  Top 0.305: 33.35,13.95 33.45,13.95 R25.2
  Top 0.406: J1.P$3 33.35,13.95
SD_+3.3V  (via drill 0.3)
  Top 0.305: T2.1 44.55,62.38 | C29.1 51.5,26.5 51.5,24.3 R20.2 | 54,26.5 54,24.3 | R19.2 54,24.3 | 54,24.3 54,22.1 R23.2
  Top 0.406: v51.5,28 51.5,26.5 54,26.5 R22.2 | v43.7,62.4 44.5,62.41 T2.1 | v58,34.9 58,46.2 54,50.2 v54,61.2
  Top 0.61: R18.2 40.5,62.4 42.8,62.4 | 42.8,62.4 44.51,62.4 T2.1 | C28.1 42.8,62.4
  Bottom 0.305: 53,29.5 53,29.85 SD1.4
  Bottom 0.406: v51.5,28 53,29.5 | v43.7,62.4 52.8,62.4 v54,61.2 | v58,34.9 55.9,34.9 53,32 53,30.05 SD1.4
TXD_HOST
  Top 0.406: J1.P$2 R24.2
UA1
  Top 0.406: R53.2 77,25.25 77,23.15 R59.2 76.85,22.6 76.75,22.5 79.9,22.5 C49.1
  pour Top: 78.25,29 78.25,21.75 89.5,21.75 89.5,16 93.5,16 93.5,29
UA2
  Top 0.406: R56.2 99,25.25 99,23.15 | 99,23.15 R60.2 | 99,23.15 99,22.5 101.9,22.5 C50.1
  pour Top: 100.25,29 100.25,21.75 119,21.75 119,29
VDCF  (via drill 0.5)
  Top 0.61: D1.1 55.77,6.67 C8.1 | 55.8,11.2 v57.2,11.2 v54.4,11.2
  Top 0.813: 55.8,11.2 C6.+ 55.8,6.75 C8.1
  pour Route3 (isolate 0.305): 71.8,24.2 71.8,10.7 49.8,10.7 49.8,14.5 64.9,14.5 64.9,24.2
VDD_5V_CAM1
  Top 0.61: 95.2,18 F1.P$2
  Top 1.016: X10.1 98,15.2 95.2,18
VDD_5V_CAM2
  Top 1.016: 105.6,12 X10.3 105.6,11.98 105.6,9.7 106.8,8.5 111,8.5 112.4,9.9 F2.P$2
VDD_LINEAR
  Top 0.406: 68.25,55.75 R70.2 68.4,58.25 68.25,58.25 68.25,61.5 F6.P$1 | 68.25,55.75 C56.1 | 68.25,55.75 68.25,54.74 T13.1
VDD_LINEAR_12V
  Top 0.406: F6.P$2 68.3,66.3 71.1,69.1 X15.1
VDD_RFID1
  Top 0.406: 94.5,62 94.5,64.25 R32.2 94.65,64.35 94.65,64.95 90.2,69.3 90.2,69.88 X8.3 | C30.1 94.5,62 | 94.5,62 94.5,60.99 T4.1
VDD_RFID2
  Top 0.406: R37.2 86.07,64.33 | R37.2 86,64.25 86,62 | C31.1 86,62 | 86,62 86,60.99 T7.1 | X8.5 82.56,69.34 86.1,65.8 86.1,64.3 R37.2
VDD_RFID3
  Top 0.406: 77.65,64.65 R42.2 | R42.2 77.5,64.25 77.5,62 C32.1 77.65,61.75 77.5,61.75 77.5,60.74 T9.1 | X8.7 74.94,68.46 77.6,65.8 77.6,64.3 R42.2
VDD_SERVO
  Top 0.406: F5.P$1 61.8,61.5 59.9,59.6 59.9,58 | R69.2 59.9,58 | 59.9,58 59.9,55.75 C55.1 60.05,55.65 59.95,55.65 59.9,55.6 59.9,54.09 T12.1
VDD_SERVO_12V
  Top 0.406: F5.P$2 X14.1
VFRONT  (via drill 0.5)
  Top 0.61: v47,8.3 47,6.7 C9.1 47.1,6.67 D2.1 | v45.6,11.5 v48.4,11.5
  Top 0.813: v47,8.3 C7.+
  pour Route3 (isolate 0.305): 21.6,34.2 9.6,34.2 9.6,2 48.8,2 48.8,14.5 40.6,14.5 40.6,20.5 21.6,20.5
VMCU  (via drill 0.3, 0.5)
  Top 0.254: 28.5,45.9 28.3,45.8
  Top 0.305: 28.55,45.89 28.19,46.01 28.54,45.88 C26.2 28.5,45.9 31.9,45.9 33.06,44.74 IC2.55 | IC2.39 38.92,48.45 38.92,50.92 39.4,51.4 39.4,51.41 C24.2 | IC2.26 51.84,44.74 52.6,45.5 52.6,46.5 52.61,46.61 C18.2 52.8,46.7 v54,46.7 | IC2.8 37.92,33.67 38.6,33 C17.2 | v98,57.2 98,57.25
  Top 0.406: R28.2 96.35,55.85 96.5,56 96.5,57.92 T4.2 | T7.2 87.94,55.84 | 87.94,55.84 R34.2 | T9.2 79.19,55.75 R39.2 79.25,55.75 | R28.2 96.5,55.6 96.6,55.6 | 87.94,55.84 87.94,55.81 88,55.75 | 96.6,55.6 96.75,55.75 | 96.6,55.6 R28.2 | C26.2 C27.2 28.29,46.68 | C24.2 C22.2 | 99.5,57.32 R10.1 | 28.3,45.8 v28.3,44.7
  Top 0.61: 79.25,55.75 79.25,54.5 v79.3,54.5 v88,54.5 | v88,54.5 v95.5,54.5 96.6,55.6 | 88,55.75 v88,54.5 | R10.1 99.49,57.25 98,57.25 96.75,56 R28.2 | R10.1 99.53,57.27 | R17.2 v29.6,25.3 R15.2 | 99.5,57.23 R10.1 | D4.1 99.5,57.32 | R74.2 v5.6,49.9 | 38.01,29.8 37.36,29.8 C16.2 | v39.7,31.2 38.01,29.8 | 38.01,29.8 C17.2 | C22.2 v43.1,52.3 | v46,54.6 47.5,54.6 C11.2 47.7,54.7 L2.1
  pour Route3: 99.3,72.3 99.3,54 73.2,54 73.2,56.7 50.6,56.7 50.6,47.4 54.8,47.4 54.8,44.8 44.3,44.8 44.3,25.1 40.6,21.4 22.7,21.4 22.7,41 2.9,41 2.9,66.6 29.8,66.6 29.8,60.1 43.1,60.1 43.1,72.3
VSD  (via drill 0.3)
  Top 0.406: T2.2 R13.2 48.45,63.35 48.5,63.4 50.45,63.4 C10.1 v50.5,65
  Top 0.61: C5.+ v32.2,63.7 35.9,63.7 35.9,63.69 D3.1
  Bottom 0.406: v32.2,63.7 32.2,65 v50.5,65

## Text on the board
Top: BS | PL05052017
Route2: LY2
Route3: LY3
Bottom: LS | PL05052017
tPlace: SIGNAL | ENABLE | GND | VMCU | MOMO
tNames: ZU | AUF | LINEAR_I_AB | LINEAR_CLK | LINEAR_DIR | LINEAR_ | ENABLE | SIGNAL_PIR2 | SIGNAL_PIR1 | GND_PIR2 | GND_PIR1 | VMCU_PIR2 | VMCU_PIR1 | SCHALTER | SCHALTER | GND_SERVO | VDD_SERVO | GND_LINEAR | VDD_LINEAR | ENABLE | RFID3 | GND_RFID | ENABLE | RFID2 | GND_RFID | ENABLE | RFID1 | GND_RFID | VMCU_RFID | BATT_INPUT | BATT_GND | 1 | 1 | 2_SWDIO | 4_SWCLK | 6_SWO | 8_RESET | 8 | SERVO_AUF | SERVO_ZU | TX_RFID_2 | SCHALTER_ZU | VMCU_LB | GND_LB | SIGNAL_LB1 | SIGNAL_LB2 | RFID_GND_LB | SDA_SMBUS | SCL_SMBUS | TX_RFID_1 | DATA_RFID1 | DATA_RFID2 | DATA_RFID3 | GND_OUT1 | GND_OUT2 | RX_RFID | PWR_OUT_UA1 | PWR_OUT_UA2 | GND_SMBUS